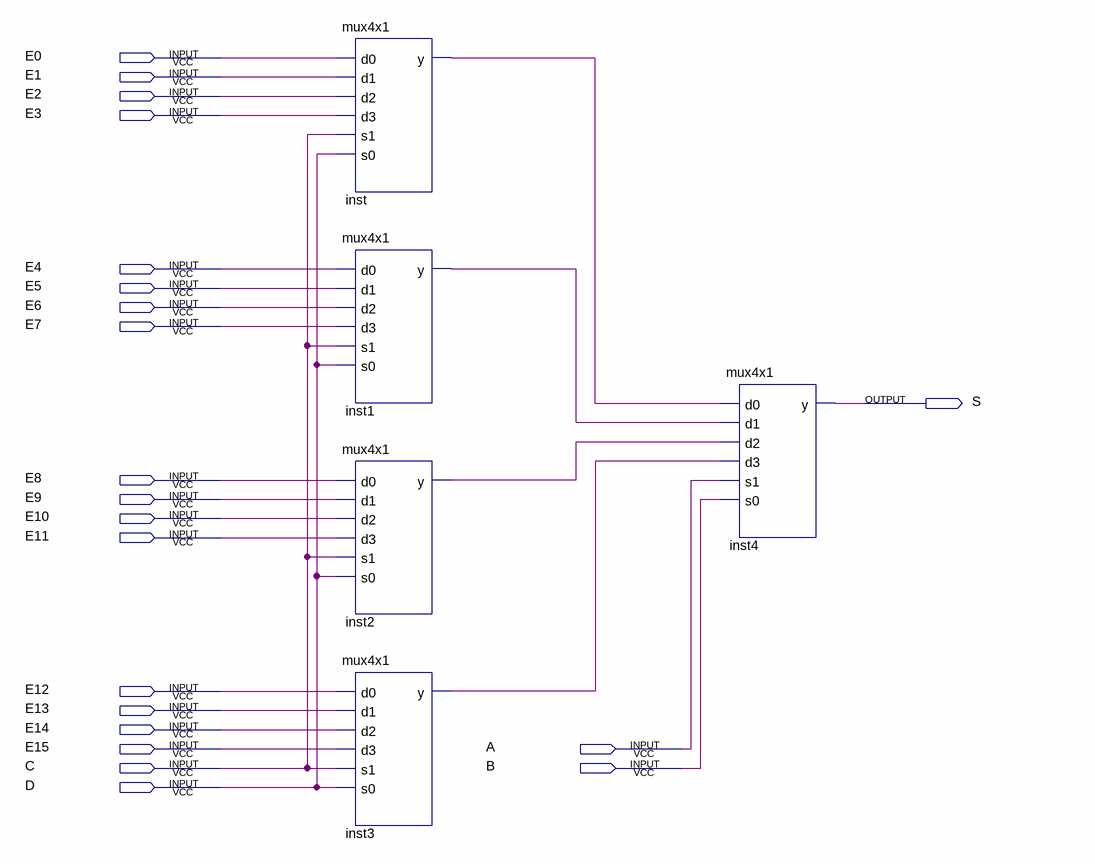
[diagram p0: schematic sheet]
// Quartus schematic mux16x1.bdf as structural Verilog: 5 symbols, 21 pins
module mux16x1 (
  input  E0,
  input  E1,
  input  E2,
  input  E3,
  input  E4,
  input  E5,
  input  E6,
  input  E7,
  input  E8,
  input  E9,
  input  E10,
  input  E11,
  input  E12,
  input  E13,
  input  E14,
  input  E15,
  input  A,
  input  C,
  input  B,
  input  D,
  output S
);

  wire inst1_y, inst2_y, inst3_y, inst_y;

  mux4x1 inst (.d0(E0), .d1(E1), .d2(E2), .d3(E3), .s1(C), .s0(D), .y(inst_y));
  mux4x1 inst1 (.d0(E4), .d1(E5), .d2(E6), .d3(E7), .s1(C), .s0(D), .y(inst1_y));
  mux4x1 inst2 (.d0(E8), .d1(E9), .d2(E10), .d3(E11), .s1(C), .s0(D), .y(inst2_y));
  mux4x1 inst3 (.d0(E12), .d1(E13), .d2(E14), .d3(E15), .s1(C), .s0(D), .y(inst3_y));
  mux4x1 inst4 (.d0(inst_y), .d1(inst1_y), .d2(inst2_y), .d3(inst3_y), .s1(A), .s0(B), .y(S));
endmodule
